# EAGLE design digitalBoardV1_1 (EAGLE 6.4)
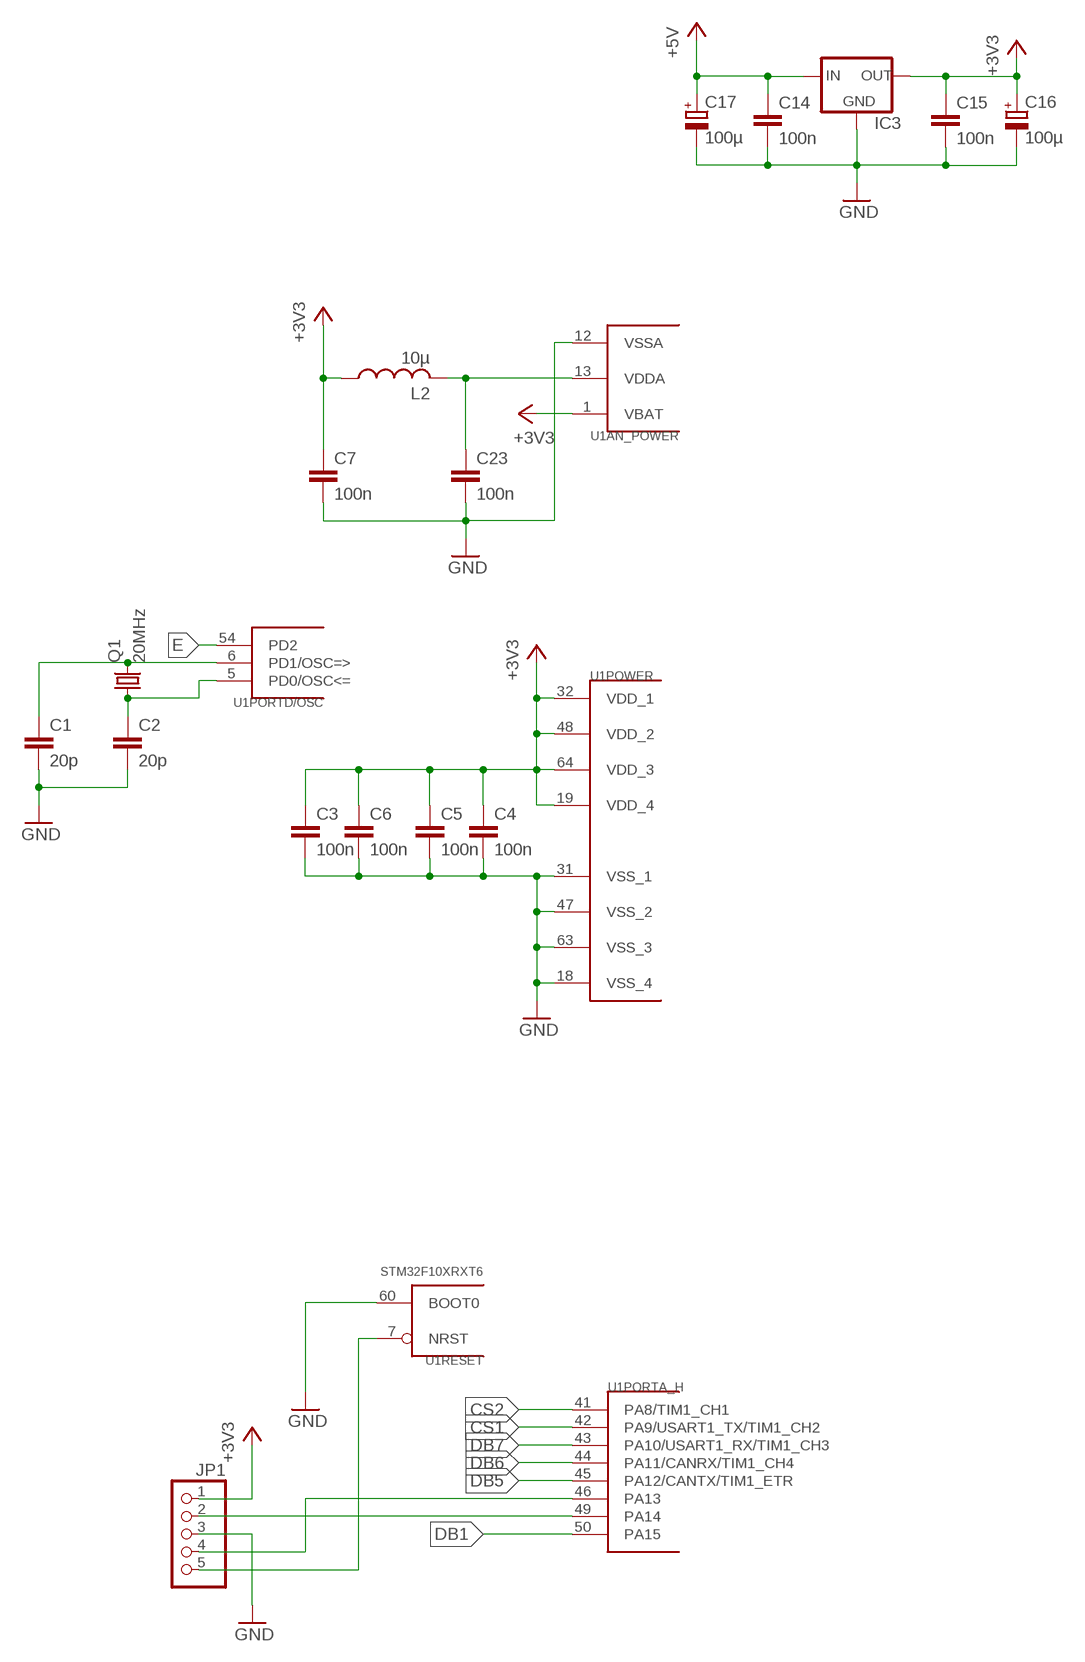
[diagram p0: schematic, sheet 1, part 1 of 2]
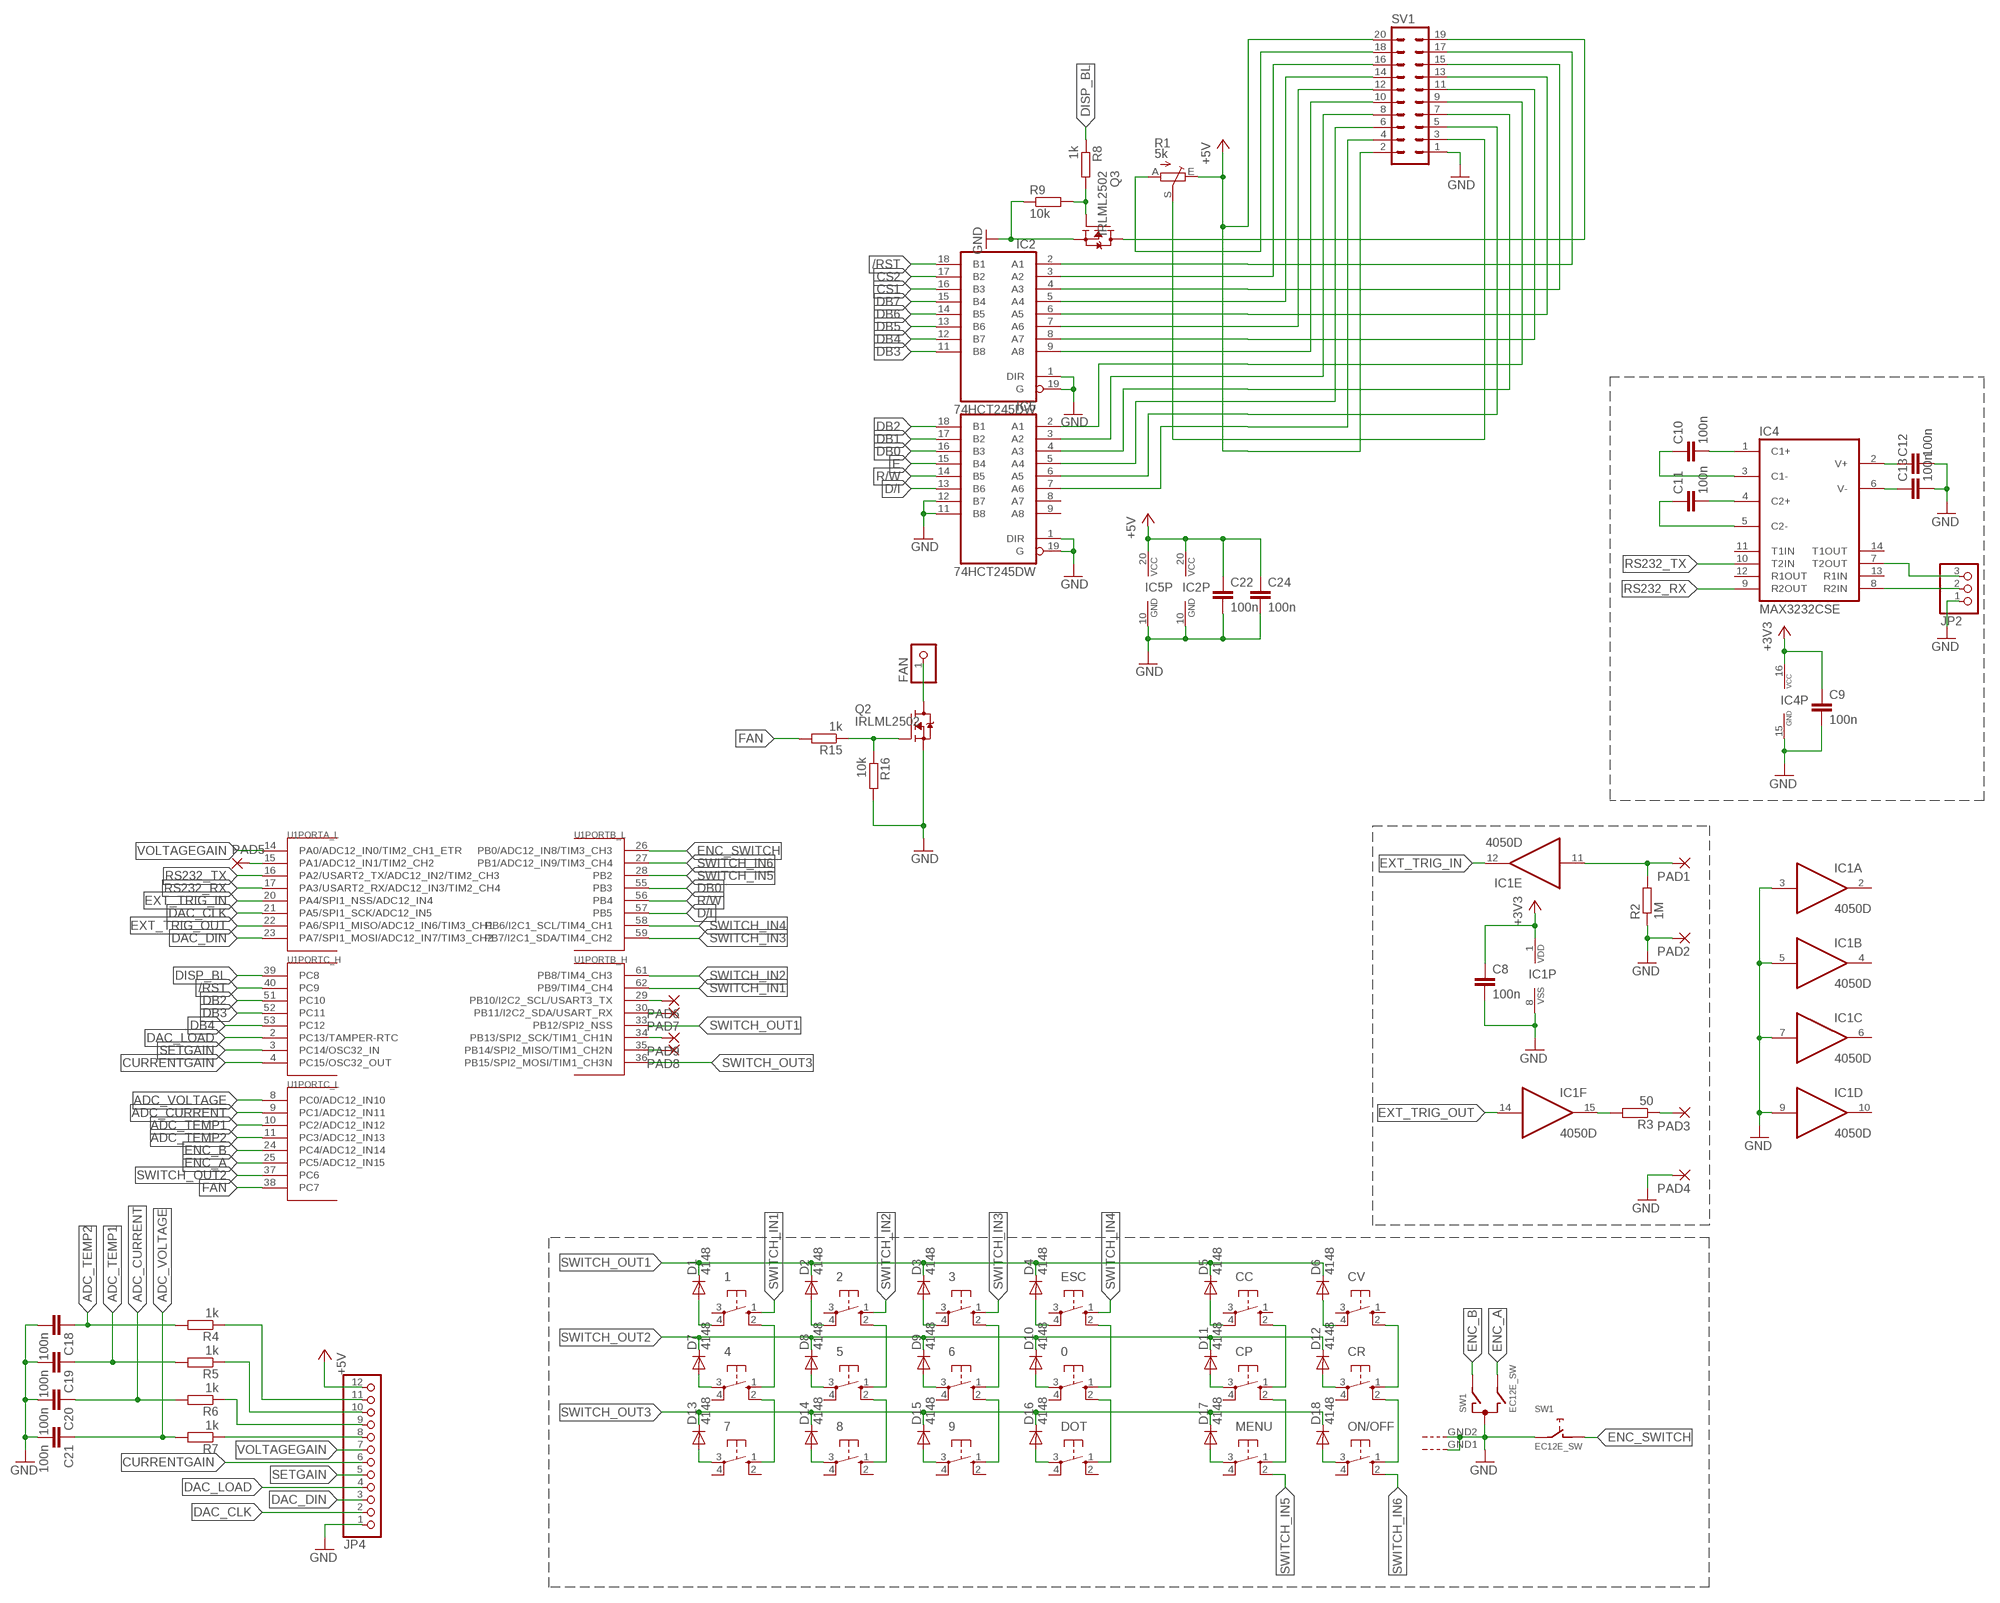
[diagram p1: schematic, sheet 1, part 2 of 2]

## Parts
0  10-XXSMD  [SMD]
1  10-XXSMD  [SMD]
2  10-XXSMD  [SMD]
3  10-XXSMD  [SMD]
4  10-XXSMD  [SMD]
5  10-XXSMD  [SMD]
6  10-XXSMD  [SMD]
7  10-XXSMD  [SMD]
8  10-XXSMD  [SMD]
9  10-XXSMD  [SMD]
C1  20p  C-EUC0603K  [C0603K]
C2  20p  C-EUC0603K  [C0603K]
C3  100n  C-EUC0603K  [C0603K]
C4  100n  C-EUC0603K  [C0603K]
C5  100n  C-EUC0603K  [C0603K]
C6  100n  C-EUC0603K  [C0603K]
C7  100n  C-EUC0603K  [C0603K]
C8  100n  C-EUC0603K  [C0603K]
C9  100n  C-EUC0603K  [C0603K]
C10  100n  C-EUC0603K  [C0603K]
C11  100n  C-EUC0603K  [C0603K]
C12  100n  C-EUC0603K  [C0603K]
C13  100n  C-EUC0603K  [C0603K]
C14  100n  C-EUC0603K  [C0603K]
C15  100n  C-EUC0603K  [C0603K]
C16  100µ  CPOL-EUE2.5-6  [E2,5-6]
C17  100µ  CPOL-EUE2.5-6  [E2,5-6]
C18  100n  C-EUC0603K  [C0603K]
C19  100n  C-EUC0603K  [C0603K]
C20  100n  C-EUC0603K  [C0603K]
C21  100n  C-EUC0603K  [C0603K]
C22  100n  C-EUC0603K  [C0603K]
C23  100n  C-EUC0603K  [C0603K]
C24  100n  C-EUC0603K  [C0603K]
CC  10-XXSMD  [SMD]
CP  10-XXSMD  [SMD]
CR  10-XXSMD  [SMD]
CV  10-XXSMD  [SMD]
D1  4148  DIODE-SOD323-R  [SOD323-R]
D2  4148  DIODE-SOD323-R  [SOD323-R]
D3  4148  DIODE-SOD323-R  [SOD323-R]
D4  4148  DIODE-SOD323-R  [SOD323-R]
D5  4148  DIODE-SOD323-R  [SOD323-R]
D6  4148  DIODE-SOD323-R  [SOD323-R]
D7  4148  DIODE-SOD323-R  [SOD323-R]
D8  4148  DIODE-SOD323-R  [SOD323-R]
D9  4148  DIODE-SOD323-R  [SOD323-R]
D10  4148  DIODE-SOD323-R  [SOD323-R]
D11  4148  DIODE-SOD323-R  [SOD323-R]
D12  4148  DIODE-SOD323-R  [SOD323-R]
D13  4148  DIODE-SOD323-R  [SOD323-R]
D14  4148  DIODE-SOD323-R  [SOD323-R]
D15  4148  DIODE-SOD323-R  [SOD323-R]
D16  4148  DIODE-SOD323-R  [SOD323-R]
D17  4148  DIODE-SOD323-R  [SOD323-R]
D18  4148  DIODE-SOD323-R  [SOD323-R]
DOT  10-XXSMD  [SMD]
ESC  10-XXSMD  [SMD]
FAN  PINHD-1X1  [1X01]
IC1  4050D  [SO16]
IC2  74HCT245DW  [SO20W]
IC3  LM1117  [SOT223]
IC4  MAX3232CSE  [SO16]
IC5  74HCT245DW  [SO20W]
JP1  PINHD-1X5  [1X05]
JP2  PINHD-1X3  [1X03]
JP4  PINHD-1X12  [1X12]
L2  10µ  INDUCTOR0805  [R0805]
MENU  10-XXSMD  [SMD]
ON/OFF  10-XXSMD  [SMD]
PAD1  SMD2  [SMD1,27-2,54]
PAD2  SMD2  [SMD1,27-2,54]
PAD3  SMD2  [SMD1,27-2,54]
PAD4  SMD2  [SMD1,27-2,54]
PAD5  SMD2  [SMD1,27-2,54]
PAD6  SMD2  [SMD1,27-2,54]
PAD7  SMD2  [SMD1,27-2,54]
PAD8  SMD2  [SMD1,27-2,54]
PAD9  SMD2  [SMD1,27-2,54]
Q1  20MHz  CRYSTALCTS406  [CTS406]
Q2  IRLML2502  [SOT23-3]
Q3  IRLML2502  [SOT23-3]
R1  5k  TRIM_EU-RJ9W  [RJ9W]
R2  1M  R-EU_R0603  [R0603]
R3  50  R-EU_R0603  [R0603]
R4  1k  R-EU_R0603  [R0603]
R5  1k  R-EU_R0603  [R0603]
R6  1k  R-EU_R0603  [R0603]
R7  1k  R-EU_R0603  [R0603]
R8  1k  R-EU_R0603  [R0603]
R9  10k  R-EU_R0603  [R0603]
R15  1k  R-EU_R0603  [R0603]
R16  10k  R-EU_R0603  [R0603]
SV1  ML20  [ML20]
SW1  EC12E_SW  [ALPS_EC12E_SW]
U1  STM32F10XRXT6  [TQFP64]

## Nets
+3V3: C3.1 C4.1 C5.1 C6.1 C7.1 C8.1 C9.1 C15.1 C16.+ IC1.1(P:VDD) IC3.2(OUT) IC4.16(VCC) JP1.1 L2.1 U1.1(AN_POWER:VBAT) U1.19(POWER:VDD_4) U1.32(POWER:VDD_1) U1.48(POWER:VDD_2) U1.64(POWER:VDD_3)
+5V: C14.1 C17.+ C22.1 C24.1 IC2.20(VCC) IC3.3(IN) IC5.20(VCC) JP4.12 R1.E SV1.2 SV1.20
/RST: IC2.18(B1) U1.40(PORTC_H:PC9)
ADC_CURRENT: C20.1 R6.2 U1.9(PORTC_L:PC1/ADC12_IN11)
ADC_TEMP1: C19.1 R5.2 U1.10(PORTC_L:PC2/ADC12_IN12)
ADC_TEMP2: C18.1 R4.2 U1.11(PORTC_L:PC3/ADC12_IN13)
ADC_VOLTAGE: C21.1 R7.2 U1.8(PORTC_L:PC0/ADC12_IN10)
CS1: IC2.16(B3) U1.42(PORTA_H:PA9/USART1_TX/TIM1_CH2)
CS2: IC2.17(B2) U1.41(PORTA_H:PA8/TIM1_CH1)
CURRENTGAIN: JP4.6 U1.4(PORTC_H:PC15/OSC32_OUT)
D/I: IC5.13(B6) U1.57(PORTB_L:PB5)
DAC_CLK: JP4.2 U1.21(PORTA_L:PA5/SPI1_SCK/ADC12_IN5)
DAC_DIN: JP4.3 U1.23(PORTA_L:PA7/SPI1_MOSI/ADC12_IN7/TIM3_CH2)
DAC_LOAD: JP4.4 U1.2(PORTC_H:PC13/TAMPER-RTC)
DB0: IC5.16(B3) U1.55(PORTB_L:PB3)
DB1: IC5.17(B2) U1.50(PORTA_H:PA15)
DB2: IC5.18(B1) U1.51(PORTC_H:PC10)
DB3: IC2.11(B8) U1.52(PORTC_H:PC11)
DB4: IC2.12(B7) U1.53(PORTC_H:PC12)
DB5: IC2.13(B6) U1.45(PORTA_H:PA12/CANTX/TIM1_ETR)
DB6: IC2.14(B5) U1.44(PORTA_H:PA11/CANRX/TIM1_CH4)
DB7: IC2.15(B4) U1.43(PORTA_H:PA10/USART1_RX/TIM1_CH3)
DISP_BL: R8.1 U1.39(PORTC_H:PC8)
E: IC5.15(B4) U1.54(PORTD/OSC:PD2)
ENC_A: SW1.B U1.25(PORTC_L:PC5/ADC12_IN15)
ENC_B: SW1.A U1.24(PORTC_L:PC4/ADC12_IN14)
ENC_SWITCH: SW1.D U1.26(PORTB_L:PB0/ADC12_IN8/TIM3_CH3)
EXT_TRIG_IN: IC1.12(E:O) U1.20(PORTA_L:PA4/SPI1_NSS/ADC12_IN4)
EXT_TRIG_OUT: IC1.14(F:I) U1.22(PORTA_L:PA6/SPI1_MISO/ADC12_IN6/TIM3_CH1)
FAN: R15.2 U1.38(PORTC_L:PC7)
GND: C1.2 C2.2 C3.2 C4.2 C5.2 C6.2 C7.2 C8.2 C9.2 C12.2 C13.2 C14.2 C15.2 C16.- C17.- C18.2 C19.2 C20.2 C21.2 C22.2 C23.2 C24.2 IC1.3(A:I) IC1.5(B:I) IC1.7(C:I) IC1.8(P:VSS) IC1.9(D:I) IC2.1(DIR) IC2.10(GND) IC2.19(G) IC3.1(GND) IC4.15(GND) IC5.1(DIR) IC5.10(GND) IC5.11(B8) IC5.12(B7) IC5.19(G) JP1.3 JP2.1 JP4.1 PAD2.1(P) PAD4.1(P) Q2.2(S) Q3.2(S) R2.1 R9.1 R16.2 SV1.1 SW1.C SW1.E SW1.GND1(G) SW1.GND2(G) U1.12(AN_POWER:VSSA) U1.18(POWER:VSS_4) U1.31(POWER:VSS_1) U1.47(POWER:VSS_2) U1.60(RESET:BOOT0) U1.63(POWER:VSS_3)
N$1: C1.1 Q1.3 U1.6(PORTD/OSC:PD1/OSC=>)
N$2: C2.1 Q1.1 U1.5(PORTD/OSC:PD0/OSC<=)
N$3: IC1.11(E:I) PAD1.1(P) R2.2
N$4: IC1.15(F:O) R3.2
N$5: PAD3.1(P) R3.1
N$6: C10.2 IC4.1(C1+)
N$7: C10.1 IC4.3(C1-)
N$8: C11.2 IC4.4(C2+)
N$9: C11.1 IC4.5(C2-)
N$10: C13.1 IC4.6(V-)
N$11: C12.1 IC4.2(V+)
N$12: JP4.8 R7.1
N$13: JP4.9 R6.1
N$14: R1.A SV1.18
N$15: JP4.10 R5.1
N$16: JP4.11 R4.1
N$17: 0.1(S) ESC.2(S1)
N$18: 0.2(S1) DOT.1(S)
N$19: C23.1 L2.2 U1.13(AN_POWER:VDDA)
N$20: IC4.8(R2IN) JP2.2
N$21: 4.2(S1) 7.1(S)
N$22: 1.2(S1) 4.1(S)
N$23: 2.2(S1) 5.1(S)
N$24: 5.2(S1) 8.1(S)
N$25: 3.2(S1) 6.1(S)
N$26: 6.2(S1) 9.1(S)
N$27: CC.2(S1) CP.1(S)
N$28: CP.2(S1) MENU.1(S)
N$29: CR.1(S) CV.2(S1)
N$30: CR.2(S1) ON/OFF.1(S)
N$31: IC4.7(T2OUT) JP2.3
N$32: 1.4(P1) D1.A
N$33: 2.4(P1) D2.A
N$34: 3.4(P1) D3.A
N$35: D4.A ESC.4(P1)
N$36: CC.4(P1) D5.A
N$37: CV.4(P1) D6.A
N$38: 4.3(P) D7.A
N$39: 7.3(P) D13.A
N$40: 8.3(P) D14.A
N$41: 5.3(P) D8.A
N$42: 6.3(P) D9.A
N$43: 9.3(P) D15.A
N$44: D16.A DOT.3(P)
N$45: PAD9.1(P) U1.34(PORTB_H:PB13/SPI2_SCK/TIM1_CH1N)
N$46: 0.3(P) D10.A
N$47: CP.3(P) D11.A
N$48: D17.A MENU.3(P)
N$49: PAD8.1(P) U1.35(PORTB_H:PB14/SPI2_MISO/TIM1_CH2N)
N$50: Q2.1(G) R15.1 R16.1
N$51: FAN.1 Q2.3(D)
N$52: D18.A ON/OFF.3(P)
N$53: CR.3(P) D12.A
N$54: R1.S SV1.3
N$55: Q3.1(G) R8.2 R9.2
N$56: IC2.2(A1) SV1.17
N$57: IC2.3(A2) SV1.16
N$58: IC2.4(A3) SV1.15
N$59: IC2.5(A4) SV1.14
N$60: IC2.6(A5) SV1.13
N$61: IC2.7(A6) SV1.12
N$62: IC2.8(A7) SV1.11
N$63: IC2.9(A8) SV1.10
N$64: IC5.2(A1) SV1.9
N$65: IC5.3(A2) SV1.8
N$66: IC5.4(A3) SV1.7
N$67: IC5.5(A4) SV1.6
N$68: IC5.6(A5) SV1.5
N$69: Q3.3(D) SV1.19
N$70: IC5.7(A6) SV1.4
N$71: PAD7.1(P) U1.30(PORTB_H:PB11/I2C2_SDA/USART_RX)
N$72: PAD6.1(P) U1.29(PORTB_H:PB10/I2C2_SCL/USART3_TX)
N$73: PAD5.1(P) U1.15(PORTA_L:PA1/ADC12_IN1/TIM2_CH2)
NRST: JP1.5 U1.7(RESET:NRST)
R/W: IC5.14(B5) U1.56(PORTB_L:PB4)
RS232_RX: IC4.9(R2OUT) U1.17(PORTA_L:PA3/USART2_RX/ADC12_IN3/TIM2_CH4)
RS232_TX: IC4.10(T2IN) U1.16(PORTA_L:PA2/USART2_TX/ADC12_IN2/TIM2_CH3)
SETGAIN: JP4.5 U1.3(PORTC_H:PC14/OSC32_IN)
SWCLK: JP1.2 U1.49(PORTA_H:PA14)
SWDIO: JP1.4 U1.46(PORTA_H:PA13)
SWITCH_IN1: 1.1(S) U1.62(PORTB_H:PB9/TIM4_CH4)
SWITCH_IN2: 2.1(S) U1.61(PORTB_H:PB8/TIM4_CH3)
SWITCH_IN3: 3.1(S) U1.59(PORTB_L:PB7/I2C1_SDA/TIM4_CH2)
SWITCH_IN4: ESC.1(S) U1.58(PORTB_L:PB6/I2C1_SCL/TIM4_CH1)
SWITCH_IN5: MENU.2(S1) U1.28(PORTB_L:PB2)
SWITCH_IN6: ON/OFF.2(S1) U1.27(PORTB_L:PB1/ADC12_IN9/TIM3_CH4)
SWITCH_OUT1: D1.C D2.C D3.C D4.C D5.C D6.C U1.33(PORTB_H:PB12/SPI2_NSS)
SWITCH_OUT2: D7.C D8.C D9.C D10.C D11.C D12.C U1.37(PORTC_L:PC6)
SWITCH_OUT3: D13.C D14.C D15.C D16.C D17.C D18.C U1.36(PORTB_H:PB15/SPI2_MOSI/TIM1_CH3N)
VOLTAGEGAIN: JP4.7 U1.14(PORTA_L:PA0/ADC12_IN0/TIM2_CH1_ETR)
Unconnected: 0.4(P1) 1.3(P) 2.3(P) 3.3(P) 4.4(P1) 5.4(P1) 6.4(P1) 7.2(S1) 7.4(P1) 8.2(S1) 8.4(P1) 9.2(S1) 9.4(P1) CC.1(S) CC.3(P) CP.4(P1) CR.4(P1) CV.1(S) CV.3(P) DOT.2(S1) DOT.4(P1) ESC.3(P) IC1.2(A:O) IC1.4(B:O) IC1.6(C:O) IC1.10(D:O) IC4.11(T1IN) IC4.12(R1OUT) IC4.13(R1IN) IC4.14(T1OUT) IC5.8(A7) IC5.9(A8) MENU.4(P1) ON/OFF.4(P1)

## Library data of the parts
0 1-9 CC CP CR CV DOT ESC MENU ON/OFF = switch-omron:10-XX: OMRON SWITCH
C1-C15 C18-C24 = resistormod:C-EU: CAPACITOR, European symbol
C16 C17 = rcl:CPOL-EU: POLARIZED CAPACITOR, European symbol
D1-D18 = diode:DIODE-: DIODE
FAN = pinhead:PINHD-1X1: PIN HEADER
IC1 = 40xx:4050: Hex non-inverting BUFFER
IC2 IC5 = 74xx-eu:74*245: Octal BUS TRANSCEIVER, 3-state
IC3 = v-reg-3:LM1117
IC4 = maxim:MAX3232*: True RS-232 Transceivers 3.0V to 5.5V, Low-Power up to 1Mbps, Using Four 0.1µF External Capacitors Source: http://pdfserv.maxim-ic.com/en/ds/MAX3222-MAX3241.pdf; MPN: MAX3232CSE; OC_FARNELL: 9725490; OC_NEWARK: 90C2890
JP1 = pinhead:PINHD-1X5: PIN HEADER
JP2 = pinhead:PINHD-1X3: PIN HEADER
JP4 = pinhead:PINHD-1X12: PIN HEADER
L2 = xmaker:INDUCTOR: Inductor
PAD1-PAD9 = wirepad:SMD2: SMD PAD
Q1 = crystal:CRYSTAL: CRYSTAL; OC_FARNELL: unknown; OC_NEWARK: unknown
Q2 Q3 = xmaker:IRLML2502: International Rectifier N-MOSFET.
R1 = pot:TRIM_EU-: POTENTIOMETER
R2-R9 R15 R16 = resistor:R-EU_: RESISTOR, European symbol
SV1 = con-harting-ml:ML20: HARTING; OC_FARNELL: unknown; OC_NEWARK: unknown
SW1 = switch-alps:EC12E_SW: ALPS rotary Encoder EC12E series with switch; MPN: EC12E2424407; OC_FARNELL: 1520813; OC_NEWARK: 74M1068
U1 = stm32:STM32F10XRXT6: STM32F101/103 64pin LQFP

## Board
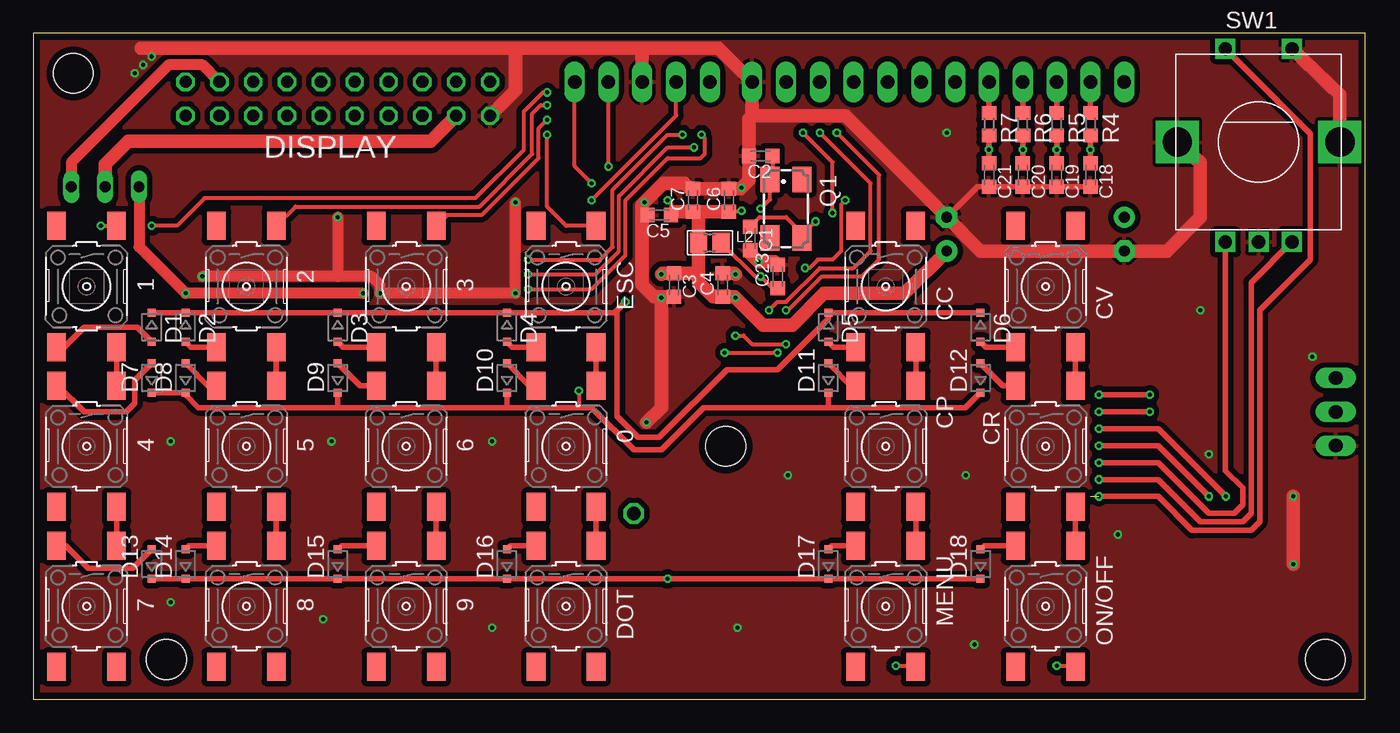
[diagram p2: board, top side]
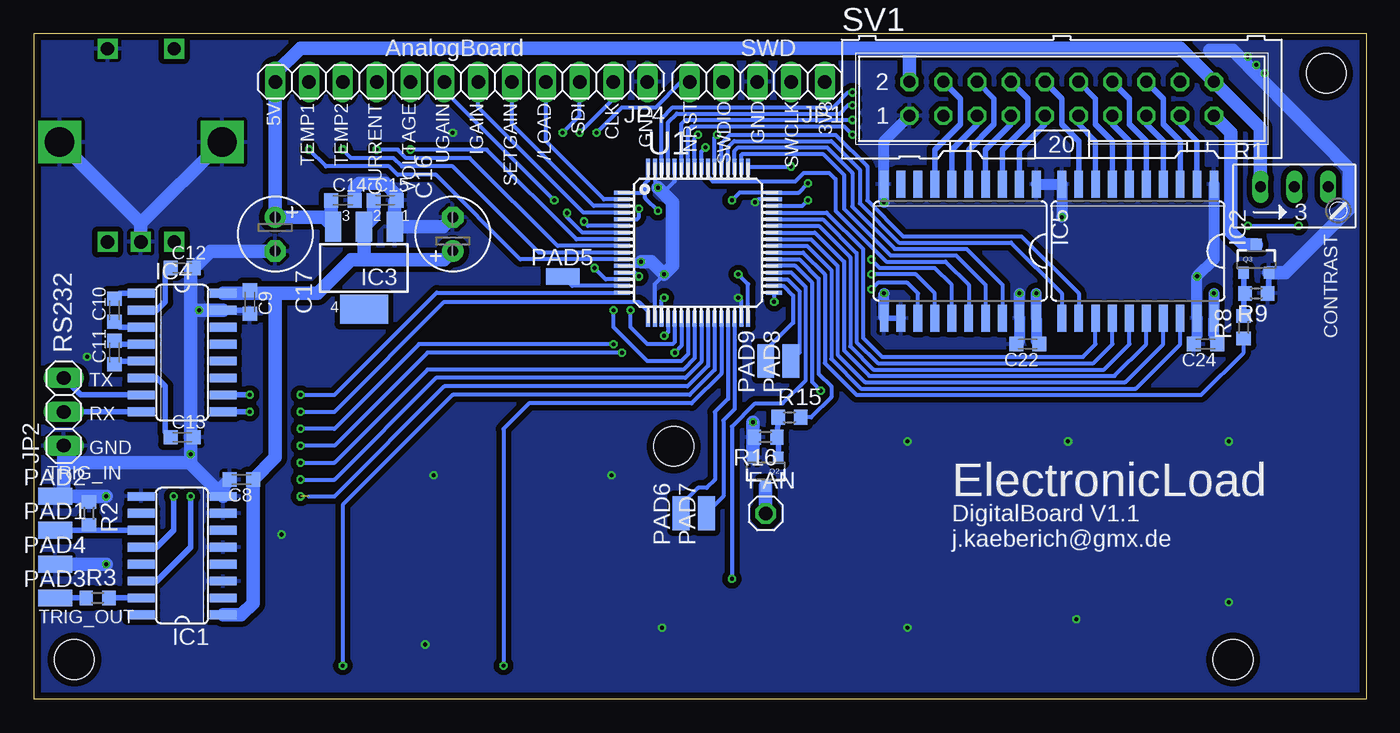
[diagram p3: board, bottom side, seen from below]

Size 100 x 50 mm. Coordinates in mm from the lower left corner, seen from the top.
Outline: 0,0 100,0 100,50 0,50 0,0
Copper layers (1*16): Top 0.035mm / dielectric 1.6mm / Bottom 0.035mm
Design rules "Elecrow_2-layer_PCB_eagle_rule": minimum track width 6mil, minimum drill 12mil, track to track 6mil, track to pad 6mil, pad to pad 6mil, via to via 8mil, smd to smd 0mil, copper to edge 20mil, drill to drill 10mil, minimum pad ring 6mil, minimum via ring 6mil, stop-mask expansion 0mil, vias tented up to drill 100mil, thermal gap 10mil
Holes 3 mm at 3,47 97,3 52,19 10,3

### Footprints (pad centres in the part's own frame; a part is rotated, then mirrored left to right if it is on the bottom)
SMD = smd 2.1 x 1.4: 1 -4.55,2.25; 2 4.55,2.25; 3 -4.55,-2.25; 4 4.55,-2.25
C0603K = smd 1.05 x 1.08: 1 -0.875,0; 2 0.875,0
E2,5-6 = drill 0.813 pad 1.6: + -1.27,0 | drill 0.813 pad 1.6 octagon: - 1.27,0
SOD323-R = smd 0.6 x 0.6: A 1.1,0; C -1.1,0
1X01 = drill 1.016 octagon: 1 0,0
SO16 = smd 0.66 x 2.032: 1 -4.445,-3.073; 2 -3.175,-3.073; 3 -1.905,-3.073; 4 -0.635,-3.073; 5 0.635,-3.073; 6 1.905,-3.073; 7 3.175,-3.073; 8 4.445,-3.073; 9 4.445,3.073; 10 3.175,3.073; 11 1.905,3.073; 12 0.635,3.073; 13 -0.635,3.073; 14 -1.905,3.073; 15 -3.175,3.073; 16 -4.445,3.073
SO20W = smd 0.66 x 2.032: 1 -5.715,-5.029; 2 -4.445,-5.029; 3 -3.175,-5.029; 4 -1.905,-5.029; 5 -0.635,-5.029; 6 0.635,-5.029; 7 1.905,-5.029; 8 3.175,-5.029; 9 4.445,-5.029; 10 5.715,-5.029; 11 5.715,5.029; 12 4.445,5.029; 13 3.175,5.029; 14 1.905,5.029; 15 0.635,5.029; 16 -0.635,5.029; 17 -1.905,5.029; 18 -3.175,5.029; 19 -4.445,5.029; 20 -5.715,5.029
SOT223 = smd 1.219 x 2.235: 1 -2.311,-3.099; 2 0,-3.099; 3 2.311,-3.099 | smd 3.6 x 2.2: 4 0,3.099
1X05 = drill 1.016 long: 1 -5.08,0; 2 -2.54,0; 3 0,0; 4 2.54,0; 5 5.08,0
1X03 = drill 1.016 long: 1 -2.54,0; 2 0,0; 3 2.54,0
1X12 = drill 1.016 long: 1 -13.97,0; 2 -11.43,0; 3 -8.89,0; 4 -6.35,0; 5 -3.81,0; 6 -1.27,0; 7 1.27,0; 8 3.81,0; 9 6.35,0; 10 8.89,0; 11 11.43,0; 12 13.97,0
R0805 = smd 1.5 x 1.3: 1 0,-0.85; 2 0,0.85
SMD1,27-2,54 = smd 1.27 x 2.54: 1 0,0
CTS406 = smd 1.9 x 1.4: 1 -2.2,-1.2; 2 2.2,-1.2; 3 2.2,1.2; 4 -2.2,1.2
SOT23-3 = smd 0.8 x 0.9: 1 -0.95,-1; 2 0.95,-1; 3 0,1.1
RJ9W = drill 0.813 long: A 2.54,0.635; E -2.54,0.635; S 0,0.635
R0603 = smd 1 x 1.1: 1 -0.85,0; 2 0.85,0
ML20 = drill 0.914 octagon: 1 -11.43,-1.27; 2 -11.43,1.27; 3 -8.89,-1.27; 4 -8.89,1.27; 5 -6.35,-1.27; 6 -6.35,1.27; 7 -3.81,-1.27; 8 -3.81,1.27; 9 -1.27,-1.27; 10 -1.27,1.27; 11 1.27,-1.27; 12 1.27,1.27; 13 3.81,-1.27; 14 3.81,1.27; 15 6.35,-1.27; 16 6.35,1.27; 17 8.89,-1.27; 18 8.89,1.27; 19 11.43,-1.27; 20 11.43,1.27
ALPS_EC12E_SW = drill 1 square: A -2.5,-7.5; B 2.5,-7.5; C 0,-7.5; D -2.5,7; E 2.5,7 | drill 2.2 square: GND1 -6.1,0; GND2 6.1,0
TQFP64 = smd 1.2 x 0.3: 1 -5.7,3.75; 2 -5.7,3.25; 3 -5.7,2.75; 4 -5.7,2.25; 5 -5.7,1.75; 6 -5.7,1.25; 7 -5.7,0.75; 8 -5.7,0.25; 9 -5.7,-0.25; 10 -5.7,-0.75; 11 -5.7,-1.25; 12 -5.7,-1.75; 13 -5.7,-2.25; 14 -5.7,-2.75; 15 -5.7,-3.25; 16 -5.7,-3.75; 33 5.7,-3.75; 34 5.7,-3.25; 35 5.7,-2.75; 36 5.7,-2.25; 37 5.7,-1.75; 38 5.7,-1.25; 39 5.7,-0.75; 40 5.7,-0.25; 41 5.7,0.25; 42 5.7,0.75; 43 5.7,1.25; 44 5.7,1.75; 45 5.7,2.25; 46 5.7,2.75; 47 5.7,3.25; 48 5.7,3.75 | smd 0.3 x 1.2: 17 -3.75,-5.7; 18 -3.25,-5.7; 19 -2.75,-5.7; 20 -2.25,-5.7; 21 -1.75,-5.7; 22 -1.25,-5.7; 23 -0.75,-5.7; 24 -0.25,-5.7; 25 0.25,-5.7; 26 0.75,-5.7; 27 1.25,-5.7; 28 1.75,-5.7; 29 2.25,-5.7; 30 2.75,-5.7; 31 3.25,-5.7; 32 3.75,-5.7; 49 3.75,5.7; 50 3.25,5.7; 51 2.75,5.7; 52 2.25,5.7; 53 1.75,5.7; 54 1.25,5.7; 55 0.75,5.7; 56 0.25,5.7; 57 -0.25,5.7; 58 -0.75,5.7; 59 -1.25,5.7; 60 -1.75,5.7; 61 -2.25,5.7; 62 -2.75,5.7; 63 -3.25,5.7; 64 -3.75,5.7

### Placement (x,y rotation side)
0  40,19 270 top
1  4,31 270 top
2  16,31 270 top
3  28,31 270 top
4  4,19 270 top
5  16,19 270 top
6  28,19 270 top
7  4,7 270 top
8  16,7 270 top
9  28,7 270 top
C1  53.82,34.61 270 top
C2  54.61,40.8 180 top
C3  48.1,31.11 270 top
C4  51.75,31.11 90 top
C5  46.99,36.35 180 top
C6  52.23,37.47 90 top
C7  49.53,37.47 90 top
C8  84.45,16.51 180 bottom
C9  83.82,29.84 270 bottom
C10  93.98,29.21 90 bottom
C11  93.98,26.04 90 bottom
C12  88.9,32.38 0 bottom
C13  88.9,19.68 0 bottom
C14  76.83,37.47 0 bottom
C15  73.66,37.47 0 bottom
C16  68.58,34.92 90 bottom
C17  81.92,34.92 270 bottom
C18  79.38,39.37 270 top
C19  76.83,39.37 270 top
C20  74.3,39.37 270 top
C21  71.75,39.37 270 top
C22  25.4,26.67 180 bottom
C23  55.88,31.75 90 top
C24  12.06,26.67 180 bottom
CC  64,31 270 top
CP  64,19 270 top
CR  76,19 270 top
CV  76,31 270 top
D1  8.89,27.94 270 top
D2  11.43,27.94 270 top
D3  22.86,27.94 270 top
D4  35.56,27.94 270 top
D5  59.69,27.94 270 top
D6  71.12,27.94 270 top
D7  8.89,24.13 90 top
D8  11.43,24.13 90 top
D9  22.86,24.13 90 top
D10  35.56,24.13 90 top
D11  59.69,24.13 90 top
D12  71.12,24.13 90 top
D13  8.89,10.16 90 top
D14  11.43,10.16 90 top
D15  22.86,10.16 90 top
D16  35.56,10.16 90 top
D17  59.69,10.16 90 top
D18  71.12,10.16 90 top
DOT  40,7 270 top
ESC  40,31 270 top
FAN  45.09,13.97 0 bottom
IC1  88.9,10.79 90 bottom
IC2  17.14,33.66 180 bottom
IC3  75.25,32.38 180 bottom
IC4  88.9,26.04 270 bottom
IC5  30.48,33.66 180 bottom
JP1  45.72,46.35 180 bottom
JP2  97.79,21.59 90 bottom
JP4  67.94,46.35 180 bottom
L2  50.8,34.29 270 top
MENU  64,7 270 top
ON/OFF  76,7 270 top
PAD1  98.42,12.7 270 bottom
PAD2  98.42,15.24 270 bottom
PAD3  98.42,7.62 270 bottom
PAD4  98.42,10.16 270 bottom
PAD5  60.33,31.75 270 bottom
PAD6  51.44,13.97 0 bottom
PAD7  49.53,13.97 0 bottom
PAD8  43.18,25.4 0 bottom
PAD9  45.09,25.4 0 bottom
Q1  56.52,36.83 270 top
Q2  45.09,17.14 180 bottom
Q3  8.26,33.02 0 bottom
R1  5.4,37.84 0 bottom
R2  95.89,13.97 270 bottom
R3  95.25,7.62 0 bottom
R4  79.38,43.18 270 top
R5  76.83,43.18 270 top
R6  74.3,43.18 270 top
R7  71.75,43.18 270 top
R8  9.21,27.94 90 bottom
R9  8.26,30.48 180 bottom
R15  43.3,21.18 0 bottom
R16  45.09,19.68 180 bottom
SV1  22.86,45.09 0 bottom
SW1  92,41.84 0 top
U1  50.16,34.29 0 bottom

### Tracks (layer width: path | path; a pad name or v marks a point on that pad's centre or on a via)
+3V3  (via drill 0.3)
  Top 0.305: v47.62,37.47 47.87,37.23 C5.1 | v52.7,30.16 52.63,30.24 | v53.18,36.67 53.1,36.59 C6.1 | v41.91,38.73 40.64,40.01 JP1.1
  Top 0.61: 49.95,36.17 C7.1
  Top 1.016: v47.15,31.91 47.23,31.99 C3.1 49.71,31.99 49.95,31.75 | 52.63,30.24 C4.1 51.04,30.24 49.95,31.33 49.95,31.75 | 49.95,31.75 L2.1 49.95,36.17 | C6.1 C7.1 48.1,36.59 C5.1 | C16.+ 65.41,30.48 59.37,30.48 56.99,28.1 54.77,28.1 v52.7,30.16
  Bottom 0.305: v47.62,37.47 47.05,38.04 U1.48 42.6,38.04 v41.91,38.73 | U1.32 46.41,31.18 v47.15,31.91 | U1.19 52.91,29.95 v52.7,30.16 | v53.18,36.67 54.13,37.62 54.13,38.1 | 54.13,38.1 54.13,38.73 53.91,38.95 U1.64 | U1.1 54.19,38.04 54.13,38.1
  Bottom 0.406: IC4.16 84.06,30.48 C9.1
  Bottom 1.016: C15.1 74.53,36.2 IC3.2 75.25,33.02 | 75.25,33.02 69.22,33.02 C16.+ | IC4.16 81.92,30.48 | 81.92,30.48 78.74,30.48 76.2,33.02 75.25,33.02 | IC1.1 84.45,6.35 83.58,7.22 C8.1 81.92,18.18 81.92,30.48
+5V  (via drill 0.3)
  Top 0.813: v24.77,30.48 v11.43,30.48 7.94,33.97 R1.E
  Bottom 0.813: v24.77,30.48 IC5.20 24.77,26.91 C22.1 | v11.43,30.48 IC2.20 11.43,27.3 C24.1
  Bottom 1.016: C14.1 77.71,35.63 IC3.3 78.27,36.2 C17.+ JP4.12 81.92,46.99 80.01,48.9 34.29,48.9 | 34.29,48.9 13.97,48.9 SV1.20 7.94,42.86 R1.E | SV1.2 34.29,48.9
/RST
  Bottom 0.305: U1.40 41.98,34.04 40.16,32.23 40.16,25.56 37.94,23.34 17.3,23.34 13.97,26.67 IC2.18
ADC_CURRENT  (via drill 0.3)
  Top 0.406: C20.1 v74.3,41.27 R6.2
  Bottom 0.305: U1.9 60.71,34.04 67.31,40.64 72.07,40.64 72.71,41.27 v74.3,41.27
ADC_TEMP1  (via drill 0.3)
  Top 0.406: C19.1 v76.83,41.27 R5.2
  Bottom 0.305: U1.10 62.12,33.54 68.58,40.01 72.39,40.01 73.03,40.64 76.2,40.64 v76.83,41.27
ADC_TEMP2  (via drill 0.3)
  Top 0.406: C18.1 v79.38,41.27 R4.2
  Bottom 0.305: U1.11 63.52,33.04 69.85,39.37 72.71,39.37 73.34,40.01 78.11,40.01 v79.38,41.27
ADC_VOLTAGE  (via drill 0.3)
  Top 0.406: C21.1 v71.75,41.27 R7.2
  Bottom 0.305: U1.8 59.3,34.54 66.04,41.27 v71.75,41.27
CS1
  Bottom 0.305: U1.42 41.39,35.04 39.21,32.86 39.21,26.19 37.31,24.29 18.89,24.29 16.51,26.67 IC2.16
CS2
  Bottom 0.305: U1.41 41.68,34.54 39.69,32.54 39.69,25.88 37.62,23.81 18.1,23.81 15.24,26.67 IC2.17
CURRENTGAIN
  Bottom 0.305: U1.4 58.77,36.54 66.67,44.45 JP4.6
D/I  (via drill 0.3)
  Top 0.305: v37.15,30.8 41.91,30.8 44.45,33.34 44.45,37.47 47.62,40.64 50.1,40.64 50.41,40.96 50.41,42.14 v50.16,42.39
  Bottom 0.305: U1.57 50.41,42.14 v50.16,42.39 | IC5.13 33.66,30.48 34.45,31.27 36.67,31.27 v37.15,30.8
DAC_CLK  (via drill 0.3)
  Top 0.305: v55.24,29.21 55.88,29.84 56.52,29.84 59.05,32.38 61.59,32.38 62.87,33.66 62.87,38.73 v59.05,42.55
  Bottom 0.305: v55.24,29.21 55.24,27.94 53.98,26.67 52.07,26.67 51.91,26.82 U1.21 | v59.05,42.55 56.52,45.09 JP4.2
DAC_DIN  (via drill 0.3)
  Top 0.305: v56.52,29.21 56.67,29.21 59.21,31.75 62.23,31.75 63.5,33.02 63.5,39.37 v60.33,42.55
  Bottom 0.305: v56.52,29.21 56.52,27.94 53.98,25.4 51.44,25.4 50.91,25.92 U1.23 | v60.33,42.55 59.05,43.81 JP4.3
DAC_LOAD
  Bottom 0.305: U1.2 57.23,37.54 61.59,41.91 JP4.4
DB0
  Bottom 0.305: U1.55 49.41,39.26 49.05,38.89 42.86,38.89 42.23,39.53 40.32,39.53 39.85,39.05 39.85,36.67 36.04,32.86 31.59,32.86 29.84,31.11 IC5.16
DB1
  Bottom 0.305: U1.50 46.91,40.87 46.83,40.96 40.8,40.96 39.21,39.37 39.21,36.83 35.72,33.34 30.8,33.34 28.57,31.11 IC5.17
DB2
  Bottom 0.305: U1.51 47.41,41.17 47.15,41.43 40.48,41.43 38.58,39.53 38.58,36.99 35.4,33.81 30,33.81 27.3,31.11 IC5.18
DB3
  Bottom 0.305: U1.52 47.91,41.46 47.47,41.91 40.16,41.91 38.02,39.77 38.02,37.23 35.08,34.29 26.67,34.29 22.86,30.48 IC2.11
DB4
  Bottom 0.305: U1.53 48.41,41.76 47.78,42.39 39.85,42.39 37.47,40.01 37.47,37.47 34.77,34.77 25.88,34.77 21.59,30.48 IC2.12
DB5
  Bottom 0.305: U1.45 40.51,36.54 37.78,33.81 37.78,27.15 36.35,25.72 21.27,25.72 20.32,26.67 IC2.13
DB6
  Bottom 0.305: U1.44 40.8,36.04 38.26,33.5 38.26,26.83 36.67,25.24 20.48,25.24 19.05,26.67 IC2.14
DB7
  Bottom 0.305: U1.43 41.1,35.54 38.73,33.18 38.73,26.51 36.99,24.77 19.68,24.77 17.78,26.67 IC2.15
DISP_BL
  Bottom 0.305: U1.39 42.27,33.54 40.64,31.91 40.64,25.24 38.26,22.86 12.38,22.86 9.21,26.04 R8.1
E  (via drill 0.3)
  Top 0.305: v37.15,33.02 42.55,33.02 43.5,33.97 43.5,38.26 47.62,42.39 v48.74,42.39
  Bottom 0.305: U1.54 48.91,42.21 v48.74,42.39 | IC5.15 31.11,31.11 32.38,32.38 36.51,32.38 v37.15,33.02
ENC_A  (via drill 0.3)
  Top 0.406: SW1.B 91.44,31.28 91.44,13.97 90.81,13.34 87.63,13.34 84.45,16.51 v80.01,16.51
  Bottom 0.305: v80.01,16.51 77.47,16.51 69.85,24.13 51.12,24.13 49.91,25.33 U1.25
ENC_B  (via drill 0.3)
  Top 0.406: SW1.A 89.5,17.18 90.81,15.88 90.81,14.61 90.17,13.97 88.27,13.97 84.45,17.78 v80.01,17.78
  Bottom 0.305: v80.01,17.78 77.47,17.78 70.48,24.77 51.28,24.77 50.41,25.63 U1.24
ENC_SWITCH  (via drill 0.3)  (1 unrouted)
  Top 0.406: SW1.D 95.89,42.46 95.89,33.02 92.08,29.21 92.08,13.34 91.44,12.7 87,12.7 84.45,15.24 v80.01,15.24
  Bottom 0.305: 79.38,15.24 77.47,15.24 69.22,23.5 50.96,23.5 49.41,25.04 U1.26
EXT_TRIG_IN  (via drill 0.3)
  Top 0.305: v52.7,27.3 53.34,27.3 53.98,26.67 v56.52,26.67
  Top 0.406: v80.01,20.32 84.45,20.32 v89.53,15.24
  Bottom 0.305: v80.01,20.32 77.47,20.32 71.12,26.67 v56.52,26.67 | U1.20 52.41,27.59 v52.7,27.3
  Bottom 0.406: IC1.12 90.81,11.43 89.53,12.7 v89.53,15.24
EXT_TRIG_OUT  (via drill 0.3)
  Top 0.305: v51.91,26.04 v55.88,26.04
  Top 0.406: v80.01,19.05 84.45,19.05 v88.27,15.24
  Bottom 0.305: v80.01,19.05 77.47,19.05 70.48,26.04 v55.88,26.04 | U1.22 51.41,26.53 v51.91,26.04
  Bottom 0.406: IC1.14 90.81,8.89 88.27,11.43 v88.27,15.24
FAN
  Bottom 0.305: U1.38 42.56,33.04 41.12,31.59 41.12,24.45 40.16,23.5 40.16,22.7 41.69,21.18 R15.2
GND  (via drill 0.3)
  Top 0.305: v53.18,38.42 53.1,38.34
  Top 0.406: C18.2 C19.2 C20.2 C21.2 70.88,38.49 C16.-
  Top 0.813: 22.86,31.75 25.4,31.75 26.04,31.11 v26.04,30.48 v36.2,30.48 v36.2,37.31 | 22.86,31.75 v12.7,31.75 | v22.86,36.2 22.86,31.75
  Top 1.016: v52.7,31.91 52.62,31.99 C4.2 | 53.1,38.34 C6.2 C7.2 49.29,38.34 48.9,38.73 47.31,38.73 v45.88,37.31 45.72,37.15 45.72,36.2 | 53.98,43.81 JP4.1 51.44,48.9 45.72,48.9 | 53.98,43.81 60.96,43.81 C16.- 71.12,33.66 C17.- 85.09,33.66 87.63,36.2 87.63,40.27 SW1.GND1 | 53.98,43.81 53.73,43.58 C2.2 53.73,38.97 v53.18,38.42 | 45.72,36.2 45.72,31.11 46.59,30.24 C3.2 47.23,30.24 v47.15,30.16 47.15,21.91 v46.04,20.8 | C5.2 45.88,36.35 45.72,36.2 | C1.2 53.82,33.5 v54.45,32.86 55.64,32.86 C23.2 | JP1.3 45.72,48.9 | 36.2,48.9 45.72,48.9 | SW1.E 98.1,45.4 SW1.GND2 | v94.61,10.16 v94.61,15.24 | SV1.1 36.2,45.72 36.2,48.9 | 36.2,48.9 8.1,48.9
  Bottom 0.305: U1.47 45.65,37.54 v45.88,37.31 | U1.31 46.91,29.93 v47.15,30.16 | U1.18 53.41,31.2 v52.7,31.91 | U1.63 53.41,38.65 v53.18,38.42 | U1.12 54.77,32.54 v54.45,32.86 | U1.60 51.91,38.89 52.78,38.02
  Bottom 0.406: IC4.15 84.06,29.21 C9.2 | IC5.11 IC5.12 | R9.1 7.3,30.58 Q3.2
  Bottom 0.813: C24.2 12.7,27.3 IC2.19 v12.7,31.75 11.43,33.02 IC2.1 | C22.2 26.04,26.91 IC5.19 v26.04,30.48 | SV1.1 36.2,41.91 IC5.10 v36.2,37.31 | IC5.11 v36.2,30.48 | IC2.10 v22.86,36.2 | IC5.1 IC2.10 | 22.83,38.68 IC2.10
  Bottom 1.016: C14.2 75.96,38.34 75.56,38.73 73.66,38.73 72.78,37.86 C15.2 72.94,37.31 IC3.1 69.29,35.48 C16.- | v53.18,38.42 52.78,38.02 52.07,37.31 52.07,32.54 v52.7,31.91 53.66,32.86 v54.45,32.86 | IC4.15 88.27,29.21 | 88.27,29.21 88.27,32.15 C12.2 86.75,33.66 C17.- | 88.27,29.21 88.27,19.93 | 88.27,19.93 C13.2 | 88.27,17.78 88.27,17.68 IC1.8 85.83,16.01 C8.2 | 88.27,17.78 88.27,19.93 | JP2.1 97.79,17.78 | 97.79,17.78 88.27,17.78 | 97.79,17.78 97.79,15.24 | 97.79,15.24 PAD2.1 v94.61,15.24 | 97.79,15.24 96.31,15.24 R2.1 | PAD4.1 v94.61,10.16 | SW1.GND2 92,35.74 | SW1.C 92,35.74 | 92,35.74 SW1.GND1 | Q3.2 6.08,32.02 1.27,36.83 1.27,39.85 10,48.74 11.75,48.74 | Q2.2 46.03,19.59 R16.2 46.04,19.79 v46.04,20.8
  other vias: 88.27,18.41 87.63,29.21 68.58,42.55 10.32,19.37 22.38,19.37 34.45,19.37 34.45,5.4 21.75,6.03 10.32,7.3 52.86,5.4 56.67,16.83 70.01,16.83 70.64,4.13 81.44,12.38 96.04,25.72 8.89,48.26 8.26,47.62 7.62,46.99
  pour Top (isolate 0.406): -0.64,50.8 100.97,50.8 100.97,-0.64 -0.64,-0.64
  pour Bottom (isolate 0.406): -0.64,50.8 100.97,50.8 100.97,-0.64 -0.64,-0.64
N$1  (via drill 0.3)
  Top 0.305: C1.1 54.53,36.2 56.52,36.2 57.72,34.99 | 57.72,34.99 Q1.3 | 57.72,34.99 57.85,34.99 v58.74,35.88
  Bottom 0.305: U1.6 58.44,35.54 58.74,35.84 v58.74,35.88
N$2  (via drill 0.3)
  Top 0.305: C2.1 55.48,39.2 Q1.1 55.31,37.53 v54.61,36.83
  Bottom 0.305: U1.5 54.77,36.04 54.61,36.2 v54.61,36.83
N$3
  Bottom 0.406: PAD1.1 95.89,12.7 | 95.89,12.7 IC1.11 | R2.2 95.89,12.7
N$4
  Bottom 0.406: R3.2 IC1.15
N$5
  Bottom 0.406: PAD3.1 R3.1
N$6
  Bottom 0.406: IC4.1 93.58,30.48 C10.2
N$7
  Bottom 0.406: IC4.3 93.58,27.94 C10.1
N$8
  Bottom 0.406: IC4.4 93.74,26.67 C11.2
N$9
  Bottom 0.406: IC4.5 93.74,25.4 C11.1
N$10
  Bottom 0.406: IC4.6 90.81,24.13 90.17,23.5 90.17,20.08 C13.1
N$11
  Bottom 0.406: IC4.2 90.81,29.21 90.17,29.84 90.17,31.99 C12.1
N$12
  Top 0.406: JP4.8 R7.1
N$13
  Top 0.406: JP4.9 R6.1
N$14
  Top 0.813: SV1.18 12.7,47.62 10.16,47.62 2.86,40.32 R1.A
N$15
  Top 0.406: JP4.10 R5.1
N$16
  Top 0.406: JP4.11 R4.1
N$17
  Top 0.406: 0.1 ESC.2
N$18
  Top 0.406: DOT.1 0.2
N$19  (via drill 0.3)
  Top 0.305: C23.1 55.48,30.88 v54.61,31.75 54.19,31.75 L2.2
  Bottom 0.305: U1.13 54.9,32.04 v54.61,31.75
N$20
  Bottom 0.406: IC4.8 JP2.2
N$21
  Top 0.406: 7.1 4.2
N$22
  Top 0.406: 4.1 1.2
N$23
  Top 0.406: 5.1 2.2
N$24
  Top 0.406: 8.1 5.2
N$25
  Top 0.406: 6.1 3.2
N$26
  Top 0.406: 9.1 6.2
N$27
  Top 0.406: CP.1 CC.2
N$28
  Top 0.406: MENU.1 CP.2
N$29
  Top 0.406: CR.1 CV.2
N$30
  Top 0.406: ON/OFF.1 CR.2
N$31
  Bottom 0.406: IC4.7 96.52,22.86 JP2.3
N$32
  Top 0.406: 1.4 2.32,26.45 3.81,27.94 7.79,27.94 D1.A
N$33
  Top 0.406: 2.4 11.82,26.45 D2.A
N$34
  Top 0.406: 3.4 23.25,26.45 D3.A
N$35
  Top 0.406: ESC.4 35.95,26.45 D4.A
N$36
  Top 0.406: CC.4 60.08,26.45 D5.A
N$37
  Top 0.406: CV.4 71.51,26.45 D6.A
N$38
  Top 0.406: 4.3 1.85,23.55 3.81,21.59 6.99,21.59 7.62,22.23 7.62,23.96 D7.A
N$39
  Top 0.406: 7.3 2.42,11.55 4.13,9.84 7.47,9.84 D13.A
N$40
  Top 0.406: 8.3 11.72,11.55 D14.A
N$41
  Top 0.406: 5.3 13.11,23.55 D8.A
N$42
  Top 0.406: 6.3 24.54,23.55 D9.A
N$43
  Top 0.406: 9.3 23.15,11.55 D15.A
N$44
  Top 0.406: DOT.3 35.85,11.55 D16.A
N$45
  Bottom 0.305: U1.34 43.74,31.04 43.02,30.32 43.02,28.26 45.09,26.19 PAD9.1
N$46
  Top 0.406: 0.3 37.24,23.55 D10.A
N$47
  Top 0.406: CP.3 61.37,23.55 D11.A
N$48
  Top 0.406: MENU.3 59.98,11.55 D17.A
N$49
  Bottom 0.305: U1.35 43.45,31.54 42.55,30.64 42.55,26.04 PAD8.1
N$50
  Bottom 0.406: Q2.1 44.13,19.59 R16.1 44.2,19.72 R15.1
N$51
  Bottom 1.016: Q2.3 FAN.1
N$52
  Top 0.406: ON/OFF.3 71.41,11.55 D18.A
N$53
  Top 0.406: CR.3 72.8,23.55 D12.A
N$54
  Top 0.61: R1.S
  Top 1.016: SV1.3 29.84,41.91 7.14,41.91 5.4,40.16 R1.S
N$55
  Bottom 0.406: R8.2 9.21,30.38 R9.2 9.21,30.58 Q3.1
N$56
  Bottom 0.406: IC2.2 12.7,41.91 13.97,43.18 SV1.17
N$57
  Bottom 0.406: IC2.3 13.97,41.91 15.24,43.18 15.24,45.09 SV1.16
N$58
  Bottom 0.406: IC2.4 15.24,41.91 16.51,43.18 SV1.15
N$59
  Bottom 0.406: IC2.5 16.51,41.91 17.78,43.18 17.78,45.09 SV1.14
N$60
  Bottom 0.406: IC2.6 17.78,41.91 19.05,43.18 SV1.13
N$61
  Bottom 0.406: IC2.7 19.05,41.91 20.32,43.18 20.32,45.09 SV1.12
N$62
  Bottom 0.406: IC2.8 20.32,41.91 21.59,43.18 SV1.11
N$63
  Bottom 0.406: IC2.9 21.59,41.91 22.86,43.18 22.86,45.09 SV1.10
N$64
  Bottom 0.406: IC5.2 26.04,41.27 24.13,43.18 SV1.9
N$65
  Bottom 0.406: IC5.3 27.3,41.27 25.4,43.18 25.4,45.09 SV1.8
N$66
  Bottom 0.406: IC5.4 28.57,41.27 26.67,43.18 SV1.7
N$67
  Bottom 0.406: IC5.5 29.84,41.27 27.94,43.18 27.94,45.09 SV1.6
N$68
  Bottom 0.406: IC5.6 31.11,41.27 29.21,43.18 SV1.5
N$69
  Bottom 1.016: SV1.19 10.16,42.55 10.16,35.08 9.2,34.12 Q3.3
N$70
  Bottom 0.406: IC5.7 32.38,41.27 30.48,43.18 30.48,45.09 SV1.4
N$71
  Bottom 0.305: U1.30 47.41,21.8 48.26,20.95 48.26,15.24 PAD7.1
N$72
  Bottom 0.305: U1.29 47.91,22.57 48.9,21.59 48.9,16.51 49.53,15.88 50.16,15.88 51.44,14.61 PAD6.1
N$73
  Bottom 0.305: U1.15 59.62,31.04 PAD5.1
NRST  (via drill 0.3)
  Top 0.305: v60.01,36.51 60.01,40.32 v57.78,42.55
  Bottom 0.305: U1.7 58.85,35.04 60.01,36.2 v60.01,36.51 | v57.78,42.55 55.88,44.45 53.34,44.45 51.44,46.35 JP1.5
R/W  (via drill 0.3)
  Top 0.305: v37.15,31.91 42.23,31.91 43.97,33.66 43.97,37.78 47.62,41.43 v49.61,41.43
  Bottom 0.305: U1.56 49.91,41.13 v49.61,41.43 | IC5.14 32.38,30.48 33.81,31.91 v37.15,31.91
RS232_RX  (via drill 0.3)
  Top 0.406: v83.82,21.59 v80.01,21.59
  Bottom 0.305: U1.17 53.91,29.15 54.61,29.84 69.22,29.84 77.47,21.59 v80.01,21.59
  Bottom 0.406: IC4.9 v83.82,21.59
RS232_TX  (via drill 0.3)
  Top 0.406: v83.82,22.86 v80.01,22.86
  Bottom 0.305: v80.01,22.86 77.47,22.86 69.79,30.54 U1.16
  Bottom 0.406: IC4.10 v83.82,22.86
SETGAIN
  Bottom 0.305: U1.3 57.99,37.04 64.14,43.18 JP4.5
SWCLK  (via drill 0.3)
  Top 0.305: v43.18,40.01 JP1.2
  Bottom 0.305: U1.49 43.18,39.99 v43.18,40.01
SWDIO  (via drill 0.3)
  Top 0.305: JP1.4 48.26,43.81 v41.91,37.47
  Bottom 0.305: U1.46 42.34,37.04 v41.91,37.47
SWITCH_IN1  (via drill 0.3)
  Top 0.305: v38.58,45.56 38.26,45.56 36.83,44.13 36.83,41.27 33.18,37.62 12.86,37.62 10.79,35.56 v8.89,35.56 | 1.1 v5.08,35.56
  Bottom 0.305: U1.62 52.91,43.6 52.07,44.45 40.01,44.45 38.89,45.56 v38.58,45.56 | v8.89,35.56 v5.08,35.56
SWITCH_IN2  (via drill 0.3)
  Top 0.305: 2.1 19.69,36.99 33.5,36.99 37.47,40.96 37.47,43.97 38.1,44.61 v38.58,44.61
  Bottom 0.305: U1.61 52.41,43.31 51.75,43.97 39.53,43.97 38.89,44.61 v38.58,44.61
SWITCH_IN3  (via drill 0.3)
  Top 0.305: v38.58,43.5 37.94,42.86 37.94,40.64 33.66,36.35 31.05,36.35 3.1
  Bottom 0.305: U1.59 51.41,43.2 51.12,43.5 v38.58,43.5
SWITCH_IN4  (via drill 0.3)
  Top 0.305: ESC.1 40.02,35.55 38.58,36.99 v38.58,42.39
  Bottom 0.305: U1.58 50.91,42.75 50.64,43.02 39.21,43.02 v38.58,42.39
SWITCH_IN5  (via drill 0.3)
  Top 0.305: v64.77,2.54 66.16,2.54 MENU.2
  Bottom 0.305: U1.28 48.41,24.45 50.64,22.23 62.87,22.23 64.77,20.32 v64.77,2.54
SWITCH_IN6  (via drill 0.3)
  Top 0.305: v76.83,2.54 78.16,2.54 ON/OFF.2
  Bottom 0.305: U1.27 48.91,24.75 50.8,22.86 68.58,22.86 76.83,14.61 v76.83,2.54
SWITCH_OUT1  (via drill 0.3)
  Top 0.406: D1.C D2.C D3.C D4.C 43.65,29.04 43.81,29.21 | 43.81,29.21 43.81,21.27 45.4,19.68 46.99,19.68 52.07,24.77 55.88,24.77 59.69,28.57 D5.C D6.C | v44.45,29.84 43.81,29.21
  Bottom 0.305: U1.33 44.47,29.86 v44.45,29.84
SWITCH_OUT2  (via drill 0.3)
  Top 0.305: v40.96,23.18 40.96,21.91
  Top 0.406: D7.C D8.C 11.43,22.86 12.38,21.91 22.86,21.91 | 22.86,21.91 35.56,21.91 | D10.C 35.56,21.91 | D9.C 22.86,21.91 | D12.C 70,21.91 59.69,21.91 | D11.C 59.69,21.91 | 35.56,21.91 40.96,21.91 41.91,21.91 45.09,18.73 47.15,18.73 50.32,21.91 59.69,21.91
  Bottom 0.305: U1.37 42.86,32.54 41.59,31.27 41.59,23.81 v40.96,23.18
SWITCH_OUT3  (via drill 0.3)
  Top 0.305: v47.62,9.05 46.2,9.05 46.19,9.06 45.72,9.06
  Top 0.406: D13.C D14.C D15.C D16.C 45.72,9.06 D17.C D18.C
  Bottom 0.305: U1.36 43.15,32.04 42.07,30.96 42.07,23.97 43.81,22.23 45.88,22.23 47.62,20.48 v47.62,9.05
VOLTAGEGAIN  (via drill 0.3)
  Top 0.305: v60.96,37.47 60.64,37.15 60.64,33.66 60.01,33.02 58.9,33.02 58.26,32.38 v57.94,32.38
  Bottom 0.305: U1.14 57.1,31.54 v57.94,32.38 | v60.96,37.47 69.22,45.72 JP4.7

### Text on the board
tPlace: DISPLAY
bPlace: SWD | AnalogBoard | 3V3 | SWCLK | GND | SWDIO | NRST | GND | CLK | SDI | /LOAD | SETGAIN | IGAIN | UGAIN | VOLTAGE | CURRENT | TEMP2 | TEMP1 | 5V | CONTRAST | RS232 | TX | RX | GND | TRIG_IN | ElectronicLoad | DigitalBoard V1.1 | j.kaeberich@gmx.de | TRIG_OUT